# Altium schematic sheet Audio.SchDoc
size A
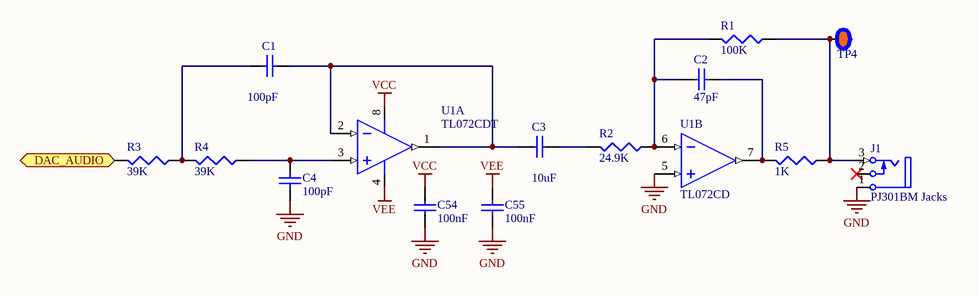
[diagram p0: Audio.SchDoc]

## Parts
C1  value 100pF  [RES_0603]  (hidden comment: CC0603JRNPO9BN101)
C2  value 47pF  [RES_0603]  (hidden comment: 06031A470FAT2A)
C3  value 10uF  [RES_1206]  (hidden comment: GRT31CR61H106ME01L)
C4  value 100pF  [RES_0603]  (hidden comment: CC0603JRNPO9BN101)
C54  value 100nF  [RES_0603]  (hidden comment: 06035G104ZAT2A)
C55  value 100nF  [RES_0603]  (hidden comment: 06035G104ZAT2A)
J1  PJ301BM Jacks  [WQP-PJ301M-12_JACK]
R1  value 100K  [RES_0603]  (hidden comment: RR0816P-104-D)
R2  value 24.9K  [RES_0603]  (hidden comment: ERA-3AEB2492V)
R3  value 39K  [RES_0603]  (hidden comment: ERA-3AEB393V)
R4  value 39K  [RES_0603]  (hidden comment: ERA-3AEB393V)
R5  value 1K  [RES_0603]  (hidden comment: RR0816P-102-D)
TP4  loop test point  [Test Point Mt Hole]  (value not drawn)
U1  TL072CDT  [TI-D8_N]  (parts A,B of 2)

## Ports
DAC_AUDIO (in)

## Nets
GND: C4.1 C54.1 C55.1 J1.1(S) U1.5(IN2+)
VCC: C54.2 U1.8(V+)
VEE: C55.2 U1.4(V-)
DAC_AUDIO: R3.2 ; port DAC_AUDIO
NetC1_1: C1.1 R3.1 R4.2
NetC1_2: C1.2 C3.1 U1.1(OUT1) U1.2(IN1-)
NetC2_1: C2.1 R5.2 U1.7(OUT2)
NetC2_2: C2.2 R1.2 R2.1 U1.6(IN2-)
NetC3_2: C3.2 R2.2
NetC4_2: C4.2 R4.1 U1.3(IN1+)
NetJ1_3: J1.3(T) R1.1 R5.1 TP4.1

Not connected (* = marked no-connect by the designer): J1 2(TN)*

## Library data of the parts
C1 C4 = Cap: Capacitor; Manufacturer: Yageo; Manufacturer Part Number: CC0603JRNPO9BN101; Supplier 1: Digi-Key; Supplier Part Number 1: 311-1069-1-ND
C2 C54 C55 = Cap: Capacitor; Manufacturer: AVX Corporation; Supplier 1: Digi-Key
  C2: Manufacturer Part Number: 06031A470FAT2A; Supplier Part Number 1: 478-3691-1-ND
  C54 C55: Manufacturer Part Number: 06035G104ZAT2A; Supplier Part Number 1: 478-3724-1-ND
C3 = Cap: Capacitor; Manufacturer: Murata; Supplier 1: Digi-Key; Supplier Part Number 1: 490-12457-1-ND; Manufacturer Part Number: GRT31CR61H106ME01L
J1 = Phonejack2 TN: Jack Socket, 1/4" [6.5mm], Thru-Hole, Vertical, 2-Conductor with Tip closed; Manufacturer: Thonkiconn; Manufacturer Part Number: PJ301BM Jacks
R1 R5 = Res3: Resistor; Manufacturer: Susumu; Supplier 1: Digi-Key
  R1: Manufacturer Part Number: RR0816P-104-D; Supplier Part Number 1: RR08P100KDCT-ND
  R5: Manufacturer Part Number: RR0816P-102-D; Supplier Part Number 1: RR08P1.0KDDKR-ND
R2-R4 = Res3: Manufacturer: Panasonic Electronic Components; Supplier 1: Digi-Key
  R2: Manufacturer Part Number: ERA-3AEB2492V; Supplier Part Number 1: P24.9KDBCT-ND
  R3 R4: Manufacturer Part Number: ERA-3AEB393V; Supplier Part Number 1: P39KDBCT-ND
TP4 = 402046: Test Point Loop Miniature Keysone; Manufacturer: Keystone Electronics; Manufacturer Part Number: 5003; Supplier 1: Digi-Key; Supplier Part Number 1: 36-5003-ND
U1 = TL072CD: IC OPAMP JFET 4MHZ 8SO; Manufacturer: STMicroelectronics; Manufacturer Part Number: TL072CDT; Supplier 1: Digi-Key; Supplier Part Number 1: 497-2200-1-ND